# Altium schematic sheet AFE.SchDoc: Analog Front-End
size A3; Author: M.Beldyga; CompanyName: WUT ISE; DrawnBy: M.Beldyga; Organization: WUT ISE; Address1: PW ISE; Address2: Nowowiejska 15/19 00-665 Warsaw; Address3: micbeldyga@gmail.com; SheetNumber: 3; SheetTotal: 10; ModifiedBy: -; CheckedDate: -; DivGrp: WUT ISE; Designer: M.Beldyga; ModifiedDate: -; ProjectName: Sensor Box
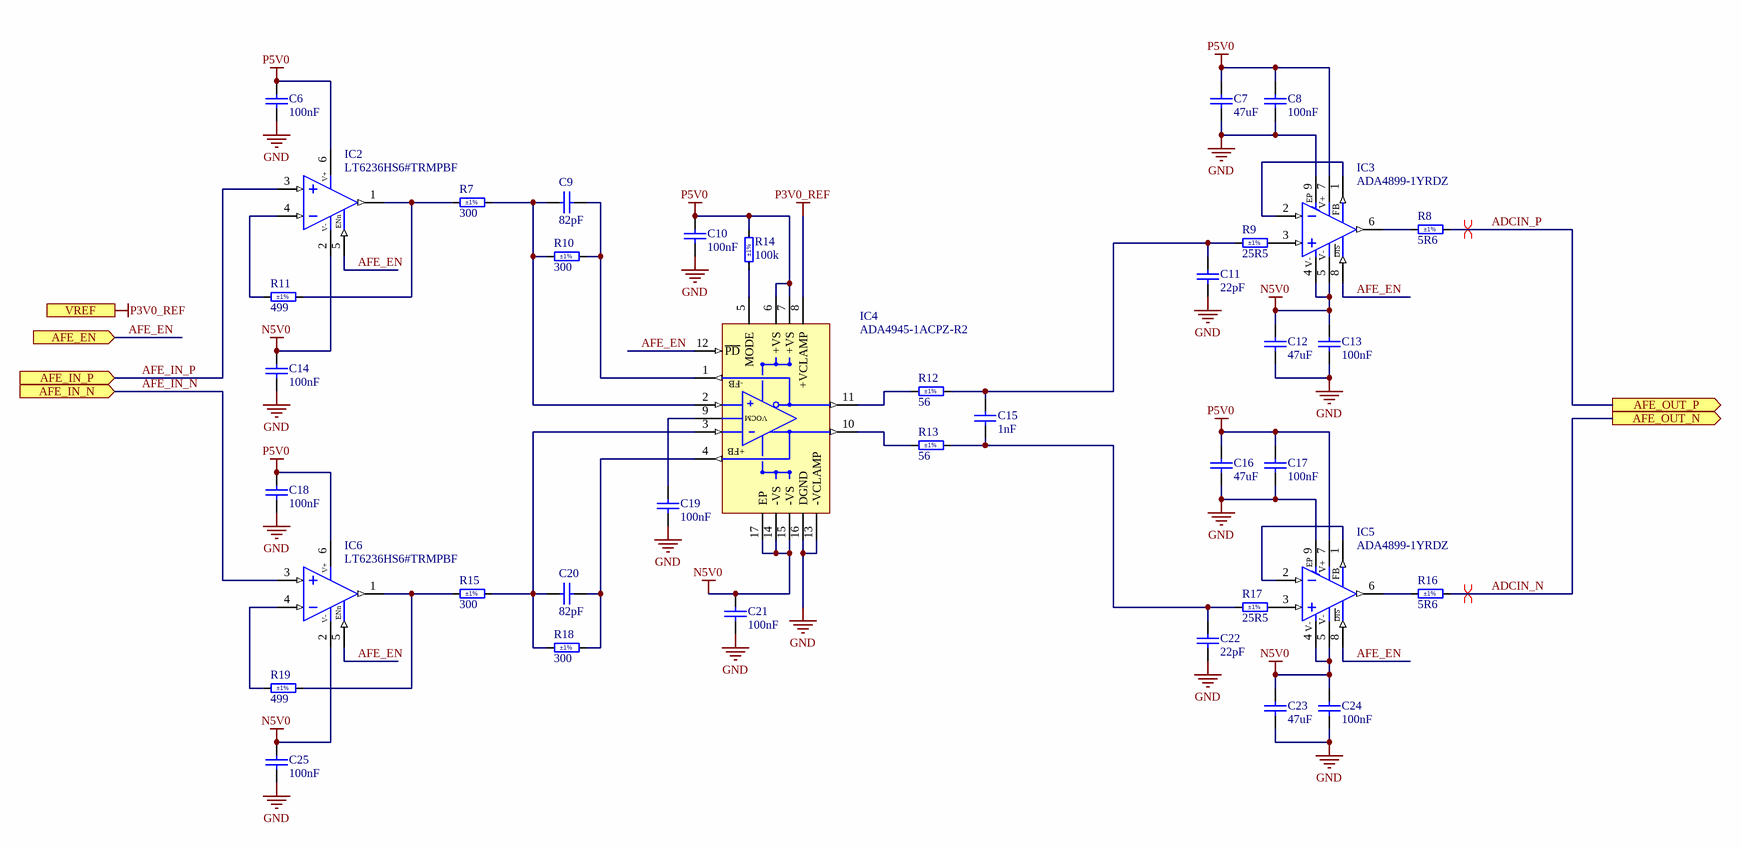
[diagram p0: AFE.SchDoc]

## Parts
C6  100nF  [CAPC1005X55N]
C7  47uF  [CAPC3216X180N]
C8  100nF  [CAPC1005X55N]
C9  82pF  [CAPC1005X55N]
C10  100nF  [CAPC1005X55N]
C11  22pF  [CAPC1005X55N]
C12  47uF  [CAPC3216X180N]
C13  100nF  [CAPC1005X55N]
C14  100nF  [CAPC1005X55N]
C15  1nF  [CAPC1005X55N]
C16  47uF  [CAPC3216X180N]
C17  100nF  [CAPC1005X55N]
C18  100nF  [CAPC1005X55N]
C19  100nF  [CAPC1005X55N]
C20  82pF  [CAPC1005X55N]
C21  100nF  [CAPC1005X55N]
C22  22pF  [CAPC1005X55N]
C23  47uF  [CAPC3216X180N]
C24  100nF  [CAPC1005X55N]
C25  100nF  [CAPC1005X55N]
IC2  LT6236HS6#TRMPBF  [SOT95P280X100-6N]
IC3  ADA4899-1YRDZ  [SOIC127P600X175-9N-S229]
IC4  ADA4945-1ACPZ-R2  [QFN50P300X300X80_HS-17N]
IC5  ADA4899-1YRDZ  [SOIC127P600X175-9N-S229]
IC6  LT6236HS6#TRMPBF  [SOT95P280X100-6N]
R7  300  Tolerance: ±1%  [RESC1005X40N]
R8  5R6  Tolerance: ±1%  [RESC1608X55N]
R9  25R5  Tolerance: ±1%  [RESC1005X40N]
R10  300  Tolerance: ±1%  [RESC1005X40N]
R11  499  Tolerance: ±1%  [RESC1005X40N]
R12  56  Tolerance: ±1%  [RESC1005X40N]
R13  56  Tolerance: ±1%  [RESC1005X40N]
R14  100k  Tolerance: ±1%  [RESC1005X40N]
R15  300  Tolerance: ±1%  [RESC1005X40N]
R16  5R6  Tolerance: ±1%  [RESC1608X55N]
R17  25R5  Tolerance: ±1%  [RESC1005X40N]
R18  300  Tolerance: ±1%  [RESC1005X40N]
R19  499  Tolerance: ±1%  [RESC1005X40N]

## Ports
AFE_EN (in), AFE_IN_N (in), AFE_IN_P (in), AFE_OUT_N (out), AFE_OUT_P (out), VREF

## Nets
GND: C6.1 C7.1 C8.1 C10.1 C11.1 C12.1 C13.1 C14.1 C16.1 C17.1 C18.1 C19.1 C21.1 C22.1 C23.1 C24.1 C25.1 IC3.9(EP) IC4.13(-VCLAMP) IC4.16(DGND) IC5.9(EP)
N5V0: C12.2 C13.2 C14.2 C21.2 C23.2 C24.2 C25.2 IC2.2(GND) IC3.4(V-) IC3.5(V-) IC4.14(-VS) IC4.15(-VS) IC4.17(EP) IC5.4(V-) IC5.5(V-) IC6.2(GND)
P3V0_REF: IC4.8(+VCLAMP) ; port VREF
P5V0: C6.2 C7.2 C8.2 C10.2 C16.2 C17.2 C18.2 IC2.6(VCC) IC3.7(V+) IC4.6(+VS) IC4.7(+VS) IC5.7(V+) IC6.6(VCC) R14.2
ADCIN_N: R16.2 ; port AFE_OUT_N
ADCIN_P: R8.2 ; port AFE_OUT_P
AFE_EN: IC2.5(~{DIS}) IC3.8(~{DIS}) IC4.12(~{PD}) IC5.8(~{DIS}) IC6.5(~{DIS}) ; port AFE_EN
AFE_IN_N: IC6.3(VP) ; port AFE_IN_N
AFE_IN_P: IC2.3(VP) ; port AFE_IN_P
NetC9_1: C9.1 IC4.2(+IN) R7.2 R10.1
NetC9_2: C9.2 IC4.1(-FB) R10.2
NetC11_2: C11.2 C15.2 R9.1 R12.2
NetC15_1: C15.1 C22.2 R13.2 R17.1
NetC19_2: C19.2 IC4.9(VOCM)
NetC20_1: C20.1 IC4.3(-IN) R15.2 R18.1
NetC20_2: C20.2 IC4.4(+FB) R18.2
NetIC2_1: IC2.1(q) R7.1 R11.2
NetIC2_4: IC2.4(VN) R11.1
NetIC3_1: IC3.1(FB) IC3.2(IN-)
NetIC3_3: IC3.3(IN+) R9.2
NetIC3_6: IC3.6(OUT) R8.1
NetIC4_5: IC4.5(MODE) R14.1
NetIC4_10: IC4.10(+OUT) R13.1
NetIC4_11: IC4.11(-OUT) R12.1
NetIC5_1: IC5.1(FB) IC5.2(IN-)
NetIC5_3: IC5.3(IN+) R17.2
NetIC5_6: IC5.6(OUT) R16.1
NetIC6_1: IC6.1(q) R15.1 R19.2
NetIC6_4: IC6.4(VN) R19.1

## Layout directives
differential pair; net class ADC_IN: ADCIN_N, ADCIN_P

## Notes on the sheet
- Project/Equipment
- Document
- Designer
- Drawn by
- Check.by
- Contact
- File
- Last Mod.
- Print Date
- Sheet
- Size
- A3
- of
- Rev
- (in symbol ADA4899-1YRDZ) DIS
- (in symbol LT6236HS6#TRMPBF) V+; ENn; V-

## Library data of the parts
C6 C8 C10 C13 C14 C17-C19 C21 C24 C25 = CC0402_100NF_50V_10%_X7R: Non-polarised capacitor; Part Description: SMD Multilayer Chip Ceramic Capacitor; Manufacturer: GENERIC; Manufacturer1 Part Number: GRM155R71H104KE14D; Voltage: 50V; TC: X7R; Tolerance: ±10%; Part Number: CC0402_100NF_50V_10%_X7R; Component Kind: Standard; Component Type: Standard; Pin Count: 2; Value: 100nF; Status: None; Manufacturer Part Number: CC0402_100NF_50V_10%_X7R; Case: 0402; Mounted: Yes; Socket: No; SMD: Yes; Sense: No; Manufacturer1 Example: MURATA; Manufacturer1 ComponentHeight: 0.55mm; HelpURL: \\cern.ch\dfs\Applications\Altium\Datasheets\CC0402_MURATA_GRM155R71H104KE14D.pdf; Author: CERN DEM MR; CreateDate: 6/30/2017; LatestRevisionDate: 6/30/2017
C7 C12 C16 C23 = CC1206_47UF_25V_20%_X5R: Non-polarised capacitor; Part Description: SMD Multilayer Chip Ceramic Capacitor; Manufacturer: GENERIC; Manufacturer1 Part Number: C3216X5R1E476M160; Voltage: 25V; TC: X5R; Tolerance: ±20%; Part Number: CC1206_47UF_25V_20%_X5R; Component Kind: Standard; Component Type: Standard; Pin Count: 2; Value: 47uF; Status: None; Manufacturer Part Number: CC1206_47UF_25V_20%_X5R; Case: 1206; Mounted: Yes; Socket: No; SMD: Yes; Sense: No; Manufacturer1 Example: TDK; Manufacturer1 ComponentHeight: 1.8mm; HelpURL: \\cern.ch\dfs\Applications\Altium\Datasheets\CC1206_X5R_TDK_C.pdf; Author: CERN DEM JLC; CreateDate: 11/20/2013; LatestRevisionDate: 3/14/2017
C9 C20 = CC0402_82PF_25V_1%_C0G_KEMET_HiQ-CBR: Non-polarised capacitor; Part Description: High Q and low ESR, SMD Multilayer Chip Ceramic Capacitor, HiQ-CBR Series; Manufacturer: KEMET; Manufacturer Part Number: CBR04C820F3GAC; Voltage: 25V; TC: C0G/NP0; Tolerance: ±1%; Part Number: CC0402_82PF_25V_1%_C0G_KEMET_HiQ-CBR; Component Kind: Standard; Component Type: Standard; Pin Count: 2; Value: 82pF; Status: Not Recommended; Case: 0402; Mounted: Yes; Socket: No; SMD: Yes; Sense: No; ComponentHeight: 0.55mm; HelpURL: \\cern.ch\dfs\Applications\Altium\Datasheets\CC0402_C0G_KEMET_HiQ-CBR.pdf; Author: CERN DEM MR; CreateDate: 11/17/2017; LatestRevisionDate: 11/21/2017
C11 C22 = CC0402_22PF_50V_5%_C0G: Non-polarised capacitor; Part Description: SMD Multilayer Chip Ceramic Capacitor; Manufacturer: GENERIC; Manufacturer1 Part Number: C0402C220J5GACTU; Voltage: 50V; TC: C0G/NP0; Tolerance: ±5%; Part Number: CC0402_22PF_50V_5%_C0G; Component Kind: Standard; Component Type: Standard; Pin Count: 2; Value: 22pF; Status: Preferred; Manufacturer Part Number: CC0402_22PF_50V_5%_C0G; Case: 0402; Mounted: Yes; Socket: No; SMD: Yes; Sense: No; Manufacturer1 Example: KEMET; Manufacturer1 ComponentHeight: 0.55mm; HelpURL: \\cern.ch\dfs\Applications\Altium\Datasheets\CC0402_C0G_KEMET_(Commercial Grade).pdf; Author: CERN DEM JLC; CreateDate: 12/3/2007; LatestRevisionDate: 12/3/2007
C15 = CC0402_1NF_50V_10%_X7R: Non-polarised capacitor; Part Description: SMD Multilayer Chip Ceramic Capacitor; Manufacturer: GENERIC; Manufacturer1 Part Number: 223858715623; Voltage: 50V; TC: X7R; Tolerance: ±10%; Part Number: CC0402_1NF_50V_10%_X7R; Component Kind: Standard; Component Type: Standard; Pin Count: 2; Value: 1nF; Status: Not Recommended; Manufacturer Part Number: CC0402_1NF_50V_10%_X7R; Case: 0402; Mounted: Yes; Socket: No; SMD: Yes; Sense: No; Manufacturer1 Example: PHYCOMP; Manufacturer1 ComponentHeight: 0.55mm; HelpURL: \\cern.ch\dfs\Applications\Altium\Datasheets\CC0402_X7R_PHYCOMP.pdf; Author: CERN DEM JLC; CreateDate: 12/3/2007; LatestRevisionDate: 12/3/2007
IC2 IC6 = LT6236HS6#TRMPBF: Rail-to-Rail Output 215MHz, 1.1nV/√Hz Op Amp/SAR ADC Driver; Manufacturer: Linear Technology; Part Number: LT6236HS6#TRMPBF; Component Kind: Standard; Component Type: Standard; Device: LT6236HS6#TRMPBF; PackageDescription: SOT23, 0.95mm pitch; 6 pin, 1.625mm W X 2.90mm L X 1.00mm H body, IPC Medium Density; Part Description: Rail-to-Rail Output 215MHz, 1.1nV/√Hz Op Amp/SAR ADC Driver; Manufacturer Part Number: LT6236HS6#TRMPBF; Pin Count: 6; Case: SOT23-6; Status: Active; Author: Michal Beldyga; CreateDate: 1/31/2025; LastRevision: 1/31/2025
IC3 IC5 = ADA4899-1YRDZ: Unity-Gain Stable, Ultralow Distortion, 1 nV/sqrt Hz Voltage Noise, High Speed Operational Amplifier; Manufacturer: ANALOG DEVICES; PressFit: No; Bonding: No; Part Number: ADA4899-1YRDZ; Component Kind: Standard; Component Type: Standard; Device: ADA4899-1YRDZ; PackageDescription: SOIC, 1.27mm Pitch; 8 Pin, 3.90mm W X 4.90mm L X 1.75mm H body (w/Thermal Tab 2.29 X 2.29mm), IPC Medium Density; Part Description: Unity-Gain Stable, Ultralow Distortion, 1nV/sqrt Hz Voltage Noise, High Speed Operational Amplifier; Manufacturer Part Number: ADA4899-1YRD; Pin Count: 9; Case: SOIC8; Mounted: Yes; Socket: No; SMD: Yes; Sense: No; ComponentHeight: 1.75mm; Author: CERN DEM JLC; HelpURL: \\cern.ch\dfs\Applications\Altium\Datasheets\ADA4899-1YRDZ.pdf; CreateDate: 1/13/2010; LatestRevisionDate: 3/31/2022
IC4 = ADA4945-1ACPZ-R2: High Speed, ±0.1 µV/˚C Offset Drift, Fully Differential ADC Driver; Manufacturer: Analog Devices; Part Number: ADA4945-1ACPZ-R2; Component Kind: Standard; Component Type: Standard; Device: ADA4945-1ACPZ-R2; PackageDescription: QFN, 16-Leads, Body 3.00x3.00mm, Pitch 0.50mm, Thermal Pad 1.60x1.60mm, IPC Medium Density; Part Description: High Speed, ±0.1 µV/˚C Offset Drift, Fully Differential ADC Driver; Manufacturer Part Number: ADA4945-1ACPZ-R2; Pin Count: 17; Case: QFN; Status: Active; Author: Michal Beldyga; CreateDate: 1/31/2025; LastRevision: 1/31/2025
R7 R10 R15 R18 = R0402_300R_1%_0.0625W_100PPM: Resistor - 1%; Part Description: General Purpose Thick Film Chip Resistor; Manufacturer: GENERIC; Manufacturer1 Part Number: 232270673001L; TC: ±100ppm/°C; PressFit: No; Part Number: R0402_300R_1%_0.0625W_100PPM; Component Kind: Standard; Component Type: Standard; Pin Count: 2; Value: 300; Status: Not Recommended; Power: 0.0625W; Manufacturer Part Number: R0402_300R_1%_0.0625W_100PPM; Case: 0402; Mounted: Yes; Sense: No; Socket: No; SMD: Yes; Manufacturer1 Example: YAGEO PHYCOMP; Manufacturer1 ComponentHeight: 0.4mm; HelpURL: \\cern.ch\dfs\Applications\Altium\Datasheets\R0402_Phycomp_RC0402.pdf; Author: CERN DEM JLC; CreateDate: 12/3/2007; LatestRevisionDate: 10/17/2012
R8 R16 = R0603_5R6_1%_0.1W_200PPM: Resistor - 1%; Part Description: General Purpose Thick Film Chip Resistor; Manufacturer: GENERIC; Manufacturer1 Part Number: 232270465608L or RC0603FR-075R6L; Power: 0.1W; TC: ±200ppm/°C; PressFit: No; Part Number: R0603_5R6_1%_0.1W_200PPM; Component Kind: Standard; Component Type: Standard; Pin Count: 2; Value: 5R6; Status: Preferred; Manufacturer Part Number: R0603_5R6_1%_0.1W_200PPM; Case: 0603; Mounted: Yes; Sense: No; Socket: No; SMD: Yes; Manufacturer1 Example: YAGEO PHYCOMP; Manufacturer1 ComponentHeight: 0.65mm; HelpURL: \\cern.ch\dfs\Applications\Altium\Datasheets\R0603_Phycomp_RC0603.pdf; Author: CERN DEM JLC; CreateDate: 6/24/2009; LatestRevisionDate: 10/17/2012
R9 R17 = R0402_25R5_1%_0.0625W_100PPM: Resistor - 1%; Part Description: General Purpose Thick Film Chip Resistor; Manufacturer: GENERIC; Manufacturer1 Part Number: CRCW040225R5FK; TC: ±100ppm/°C; PressFit: No; Part Number: R0402_25R5_1%_0.0625W_100PPM; Component Kind: Standard; Component Type: Standard; Pin Count: 2; Value: 25R5; Status: None; Power: 0.0625W; Manufacturer Part Number: R0402_25R5_1%_0.0625W_100PPM; Case: 0402; Mounted: Yes; Sense: No; Socket: No; SMD: Yes; Manufacturer1 Example: VISHAY; Manufacturer1 ComponentHeight: 0.4mm; HelpURL: \\cern.ch\dfs\Applications\Altium\Datasheets\R0402_VISHAY_CRCW e3.pdf; Author: CERN DEM JLC; CreateDate: 10/4/2016; LatestRevisionDate: 10/4/2016
R11 R19 = R0402_499R_1%_0.1W_100PPM: Resistor - 1%; Part Description: General Purpose Thick Film Chip Resistor; Manufacturer: GENERIC; Manufacturer1 Part Number: ERJ2RKF4990X; Power: 0.1W; TC: ±100ppm/°C; Voltage: 50V; PressFit: No; Part Number: R0402_499R_1%_0.1W_100PPM; Component Kind: Standard; Component Type: Standard; Pin Count: 2; Value: 499; Status: Not Recommended; Manufacturer Part Number: R0402_499R_1%_0.1W_100PPM; Case: 0402; Mounted: Yes; Sense: No; Socket: No; SMD: Yes; Manufacturer1 Example: PANASONIC; Manufacturer1 ComponentHeight: 0.4mm; HelpURL: \\cern.ch\dfs\Applications\Altium\Datasheets\R0402_PANASONIC_ERJ2RK.pdf; Author: CERN DEM MR; CreateDate: 11/22/2016; LatestRevisionDate: 11/22/2016
R12 R13 = R0402_56R_1%_0.0625W_100PPM: Resistor - 1%; Part Description: General Purpose Thick Film Chip Resistor; Manufacturer: GENERIC; Manufacturer1 Part Number: 232270675609L; TC: ±100ppm/°C; PressFit: No; Part Number: R0402_56R_1%_0.0625W_100PPM; Component Kind: Standard; Component Type: Standard; Pin Count: 2; Value: 56; Status: Not Recommended; Power: 0.0625W; Manufacturer Part Number: R0402_56R_1%_0.0625W_100PPM; Case: 0402; Mounted: Yes; Sense: No; Socket: No; SMD: Yes; Manufacturer1 Example: YAGEO PHYCOMP; Manufacturer1 ComponentHeight: 0.4mm; HelpURL: \\cern.ch\dfs\Applications\Altium\Datasheets\R0402_Phycomp_RC0402.pdf; Author: CERN DEM JLC; CreateDate: 12/3/2007; LatestRevisionDate: 10/17/2012
R14 = R0402_100K_1%_0.0625W_100PPM: Resistor - 1%; Part Description: General Purpose Thick Film Chip Resistor; Manufacturer: GENERIC; Manufacturer1 Part Number: 232270671004L; TC: ±100ppm/°C; PressFit: No; Part Number: R0402_100K_1%_0.0625W_100PPM; Component Kind: Standard; Component Type: Standard; Pin Count: 2; Value: 100k; Status: Not Recommended; Power: 0.0625W; Manufacturer Part Number: R0402_100K_1%_0.0625W_100PPM; Case: 0402; Mounted: Yes; Sense: No; Socket: No; SMD: Yes; Manufacturer1 Example: YAGEO PHYCOMP; Manufacturer1 ComponentHeight: 0.4mm; HelpURL: \\cern.ch\dfs\Applications\Altium\Datasheets\R0402_Phycomp_RC0402.pdf; Author: CERN DEM JLC; CreateDate: 12/3/2007; LatestRevisionDate: 10/17/2012